# Altium schematic sheet RFIDv1.SchDoc: Power System PCB
size A4; Author: Víctor Burgos González and Pedro M. Vallejo Muñoz; CompanyName: GranaSAT; CurrentTime: 17:21; CurrentDate: 14/02/2014
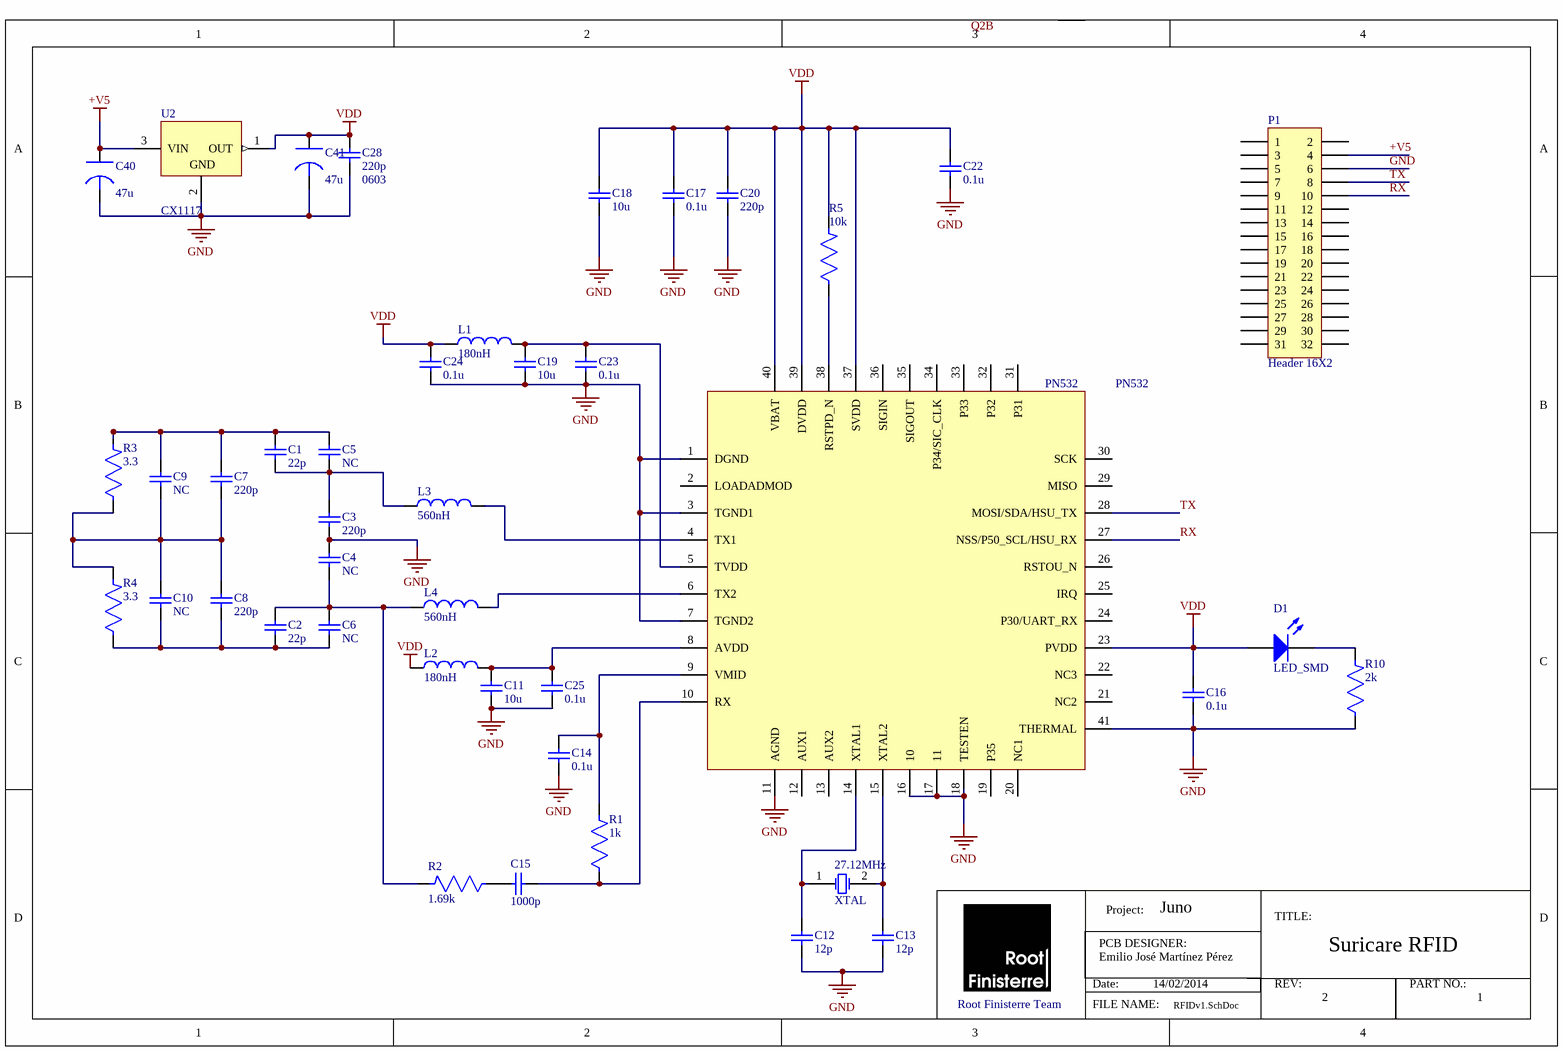
[diagram p0: RFIDv1.SchDoc]

## Parts
27.12MHz  XTAL  [Crystal SMD]
C1  22p  [0805]
C2  22p  [0805]
C3  220p  [0805]
C4  NC  [0805]
C5  NC  [0805]
C6  NC  [0805]
C7  220p  [0805]
C8  220p  [0805]
C9  NC  [0805]
C10  NC  [0805]
C11  10u  [0805]
C12  12p  [0805]
C13  12p  [0805]
C14  0.1u  [0805]
C15  1000p  [0805]
C16  0.1u  [0805]
C17  0.1u  [0805]
C18  10u  [0805]
C19  10u  [0805]
C20  value 220p  [0805]  (hidden comment: CAP)
C22  0.1u  [0805]
C23  0.1u  [0805]
C24  0.1u  [0805]
C25  0.1u  [0805]
C28  value 220p  Footprint: 0603  [0805]  (hidden comment: CAP)
C40  value 47u  [CAPAE-G]  (hidden comment: COND_ELEC)
C41  value 47u  [CAPAE-G]  (hidden comment: COND_ELEC)
D1  LED_SMD  [LED0805_GREEN]
L1  value 180nH  [INDC1608L]  (hidden comment: Inductor)
L2  value 180nH  [INDC1608L]  (hidden comment: Inductor)
L3  value 560nH  [0603]  (hidden comment: Inductor)
L4  value 560nH  [INDC1608L]  (hidden comment: Inductor)
P1  Header 16X2  [HDR2X16]
PN532  PN532  [PN532]
R1  1k  [0805]
R2  1.69k  [0805]
R3  3.3  [0805]
R4  3.3  [0805]
R5  10k  [0805]
R10  2k  [0805]
U2  CX1117  [SOT223]

## Nets
+V5: C40.1 P1.4 U2.3(VIN)
GND: C3.1 C4.2 C11.1 C12.1 C13.1 C14.1 C16.2 C17.2 C18.2 C19.2 C20.2 C22.2 C23.2 C24.2 C25.2 C28.2 C40.2 C41.2 P1.6 PN532.1(DGND) PN532.3(TGND1) PN532.7(TGND2) PN532.11(AGND) PN532.16(10) PN532.17(11) PN532.18(TESTEN) PN532.41(THERMAL) R10.1 U2.2(GND)
VDD: C16.1 C17.1 C18.1 C20.1 C22.1 C24.1 C28.1 C41.1 D1.1(A) L1.1 L2.1 PN532.23(PVDD) PN532.37(SVDD) PN532.39(DVDD) PN532.40(VBAT) R5.2 U2.1(OUT)
RX: P1.10 PN532.27(NSS/P50_SCL/HSU_RX)
TX: P1.8 PN532.28(MOSI/SDA/HSU_TX)
Net27.12MHz_1: 27.12MHz.1(OSC1) C12.2 PN532.14(XTAL1)
Net27.12MHz_2: 27.12MHz.2(OSC2) C13.2 PN532.15(XTAL2)
NetC1_1: C1.1 C3.2 C5.1 L3.1
NetC1_2: C1.2 C5.2 C7.2 C9.2 R3.2
NetC2_1: C2.1 C6.1 C8.1 C10.1 R4.1
NetC2_2: C2.2 C4.1 C6.2 L4.1 R2.2
NetC7_1: C7.1 C8.2 C9.1 C10.2 R3.1 R4.2
NetC11_2: C11.2 C25.1 L2.2 PN532.8(AVDD)
NetC14_2: C14.2 PN532.9(VMID) R1.2
NetC15_1: C15.1 PN532.10(RX) R1.1
NetC15_2: C15.2 R2.1
NetC19_1: C19.1 C23.1 L1.2 PN532.5(TVDD)
NetD1_2: D1.2(K) R10.2
NetL3_2: L3.2 PN532.4(TX1)
NetL4_2: L4.2 PN532.6(TX2)
NetPN532_38: PN532.38(RSTPD_N) R5.1

Not connected (* = marked no-connect by the designer): P1 1 2 3 5 7 9 11 12 13 14 15 16 17 18 19 20 21 22 23 24 25 26 27 28 29 30 31 32; PN532 2(LOADADMOD) 12(AUX1) 13(AUX2) 19(P35) 20(NC1) 21(NC2) 22(NC3) 24(P30/UART_RX) 25(IRQ) 26(RSTOU_N) 29(MISO) 30(SCK) 31(P31) 32(P32) 33(P33) 34(P34/SIC_CLK) 35(SIGOUT) 36(SIGIN)

## Notes on the sheet
- Project:
- Juno
- TITLE:
- Date:
- PCB DESIGNER:
- Emilio José Martínez Pérez
- REV:
- 2
- Suricare RFID
- PART NO.:
- 1
- Root Finisterre Team
- FILE NAME:
- Labels drawn without touching a wire or pin: Q2B

## Library data of the parts
27.12MHz = XTAL: Crystal Oscillator; Published: 8-Jun-2000; LatestRevisionDate: 17-Jul-2002; LatestRevisionNote: Re-released for DXP Platform.; PackageReference: R38; Publisher: Altium Limited; PackageDescription: Crystal, Thru-Hole; 2 Leads; Body 3.1 x 8.2 mm (Dia.xH)
C1-C20 C22-C25 C28 = CAP_1: Capacitor; Published: 8-Jun-2000; LatestRevisionNote: Re-released for DXP Platform.; Publisher: Altium Limited
  C1: Value: 22p
  C2: LatestRevisionDate: 17-Jul-2002; PackageReference: RAD-0.3; Value: 22p; Footprint: 0603
  C3 C7 C8: LatestRevisionDate: 17-Jul-2002; PackageReference: RAD-0.3; Value: 220p
  C4 C9: LatestRevisionDate: 17-Jul-2002; Value: NC
  C5 C10: LatestRevisionDate: 17-Jul-2002; PackageReference: RAD-0.3; Value: NC
  C6: LatestRevisionDate: 17-Jul-2002; PackageReference: RAD-0.3; Value: NC; Footprint: 0603
  C11 C18 C19: LatestRevisionDate: 17-Jul-2002; PackageReference: RAD-0.3; Value: 10u; Footprint: 0603
  C12 C13: LatestRevisionDate: 17-Jul-2002; PackageReference: RAD-0.3; Value: 12p; Footprint: 0603
  C14 C16 C17 C22-C25: LatestRevisionDate: 17-Jul-2002; PackageReference: RAD-0.3; Value: 0.1u; Footprint: 0603
  C15: LatestRevisionDate: 17-Jul-2002; PackageReference: RAD-0.3; Value: 1000p; Footprint: 0603
  C20: LatestRevisionDate: 17-Jul-2002; PackageReference: RAD-0.3; Footprint: 0603
  C28: LatestRevisionDate: 17-Jul-2002; PackageReference: RAD-0.3
C40 C41 = COND_ELEC_1: Condensador Electrolítico; Manufacturer #1: Nippon Chemi-Con; Part Number: EMV-6R3ADA102MJA0G; Tolerance: 20%; Ref. Mafero: 229; Voltage Rating: 6V3; Author: Jaime Jiménez Ortega; Cost: 0,718€; Date: 21/05/2009; Distributor: RS; Ref Distributor: 5478880; PCB DECAL: CAPAE-G
D1 = LED_SMD: LED SMD; Published: 8-Jun-2000; LatestRevisionDate: 08-Jul-2005; LatestRevisionNote: Mech Layer 1 removed.; PackageReference: LED-0; Publisher: Altium Limited
L1-L4 = Inductor: Code_IEC: 1005; Published: 8-Jun-2000; LatestRevisionDate: 29-May-2009; LatestRevisionNote: IPC-7351 Footprint Added.; PackageReference: 0402-A; Publisher: Altium Limited; PackageDescription: Chip Inductor; Code_JEITA: 0402
P1 = Header 16X2: Header, 16-Pin, Dual row; LatestRevisionDate: 17-Jul-2002; LatestRevisionNote: Re-released for DXP Platform.; Publisher: Altium Limited
R1-R5 R10 = RES_1: Resistencia; PCB DECAL: PCB_DECAL; Author: Jaime Jiménez Ortega; Date: 20/05/2009
  R1: Value: 1k
  R2: Value: 1.69k
  R3 R4: Value: 3.3
  R5: Value: 10k
  R10: Value: 2k
U2 = CX1117: adjustable  and fixed voltage regulator; Manufacturer: Silicon Cores Manuf.; PackageDescription: SOT-223/SC-73; 4 Leads; Body 6.7 x 7.3 mm, inc. leads (LxW max)